# EAGLE design GMP_SCH (EAGLE 9.6.2)
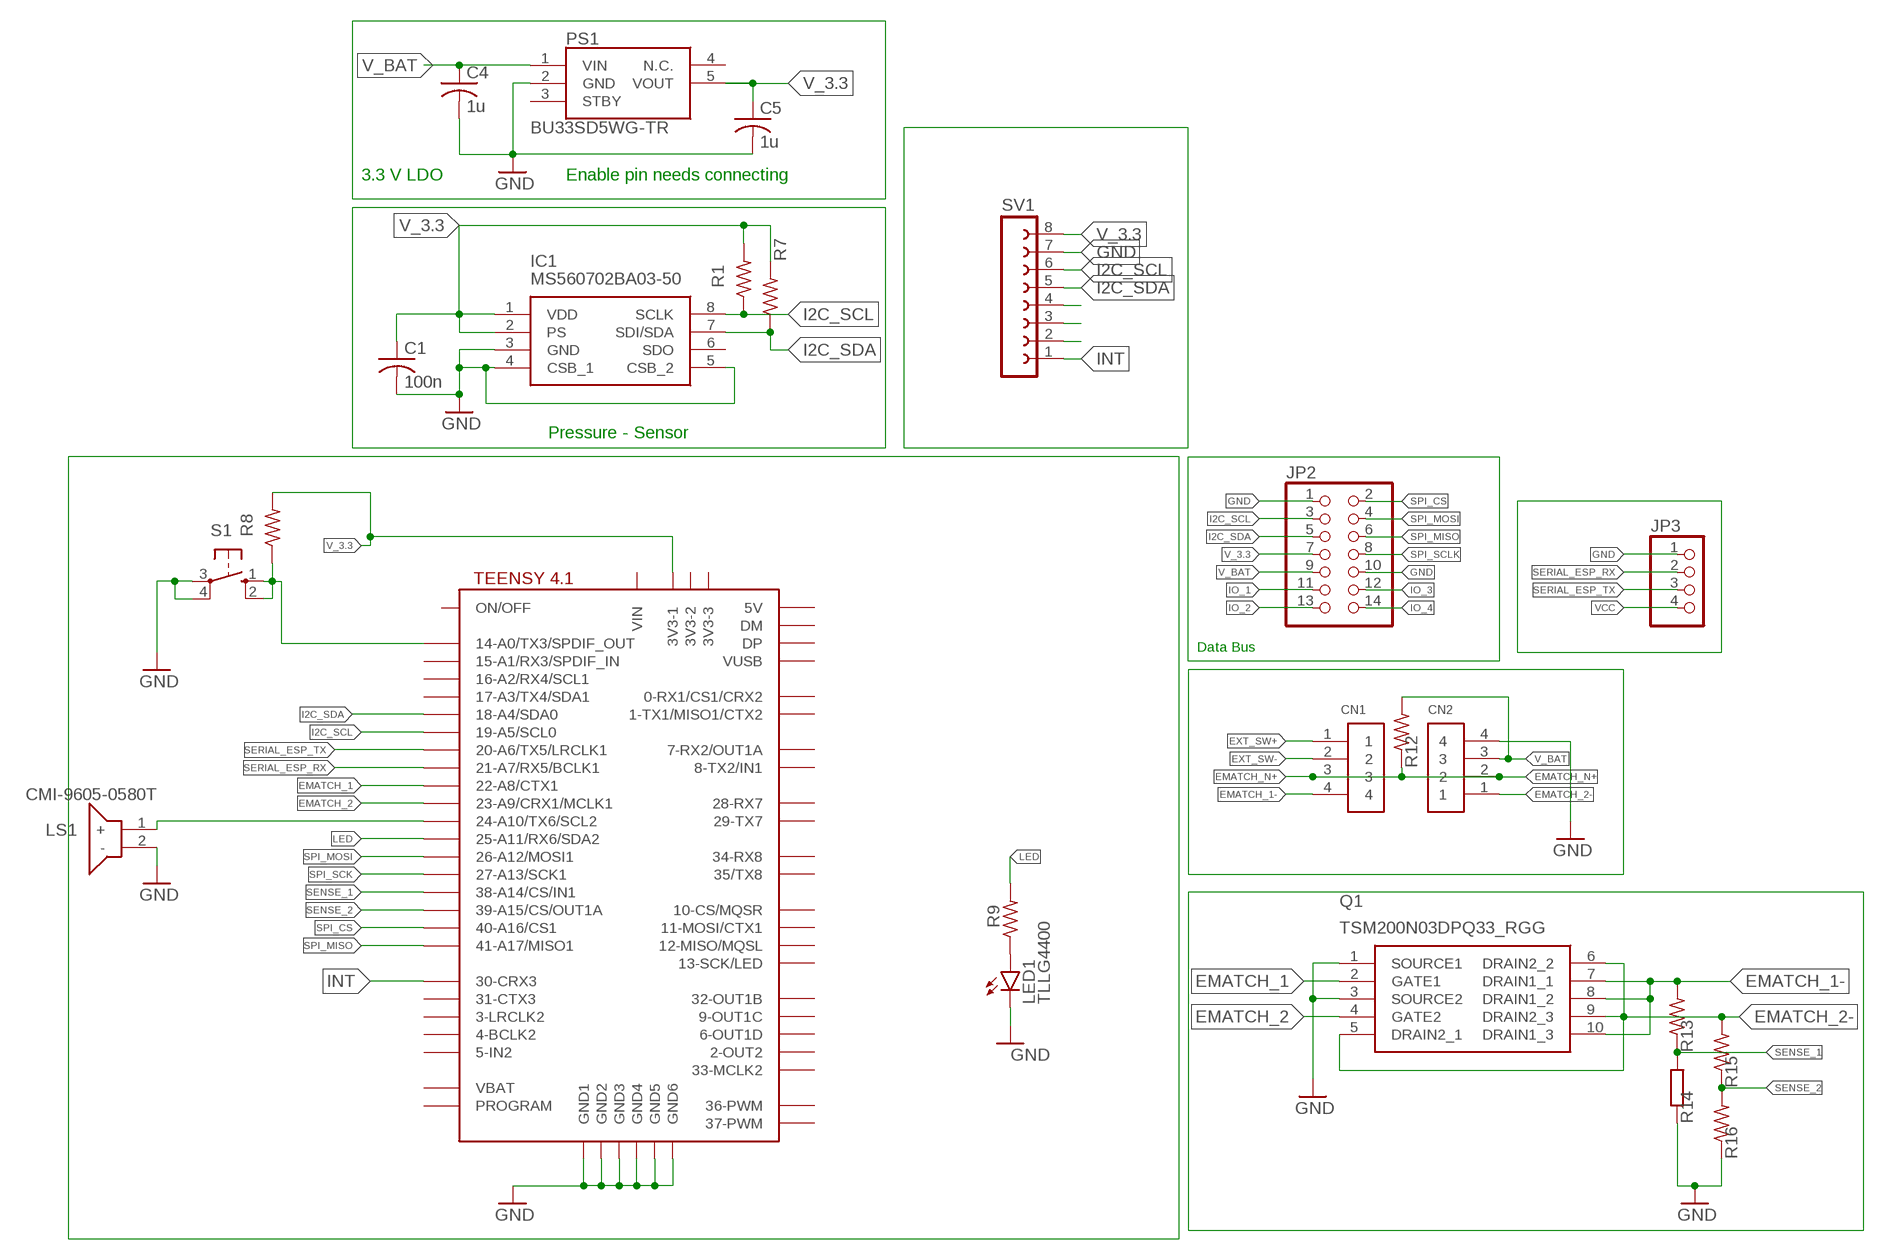
[diagram p0: schematic, sheet 1]

## Parts
C1  100n  C-USC0805  [C0805]
C4  1u  C-USC0805  [C0805]
C5  1u  C-USC0805  [C0805]
CN1  1X4-3.5MM  [1X04-3.5MM]
CN2  1X4-3.5MM  [1X04-3.5MM]
IC1  MS560702BA03-50  [MS5607-02BA03]
JP2  PINHD-2X7  [2X07]
JP3  PINHD-1X4/90  [1X04/90]
LED1  TLLG4400  [LED3MM]
LS1  CMI-9605-0580T  [CMI96050580T]
PS1  BU33SD5WG-TR  [SOT95P280X125-5N]
Q1  TSM200N03DPQ33_RGG  [TSM200N03DPQ33RGG]
R1  10k  FLIPFLOP-RES  [0805-THM]
R7  10k  FLIPFLOP-RES  [0805-THM]
R8  10k  FLIPFLOP-RES  [0805-THM]
R9  2k  FLIPFLOP-RES  [0805-THM]
R12  0  FLIPFLOP-RES  [0805-THM]
R13  100k  FLIPFLOP-RES  [0805-THM]
R14  27k  R-EU_0207/12  [0207/12]
R15  100k  FLIPFLOP-RES  [0805-THM]
R16  27k  FLIPFLOP-RES  [0805-THM]
S1  10-XX  [B3F-10XX]
SV1  FE08-1  [FE08]
U$1  TEENSY41-E  [TENNSY41-E]

## Nets
EMATCH_1: Q1.2(GATE1) U$1.22-A8/CTX1
EMATCH_1-: CN1.4 Q1.7(DRAIN1_1) Q1.8(DRAIN1_2) Q1.10(DRAIN1_3) R13.2
EMATCH_2: Q1.4(GATE2) U$1.23-A9/CRX1/MCLK1
EMATCH_2-: CN2.1 Q1.5(DRAIN2_1) Q1.6(DRAIN2_2) Q1.9(DRAIN2_3) R15.2
EMATCH_N+: CN1.3 CN2.2 R12.1
EXT_SW+: CN1.1
EXT_SW-: CN1.2
GND: C1.2 C4.2 C5.2 CN2.4 IC1.3(GND) IC1.4(CSB_1) IC1.5(CSB_2) JP2.1 JP2.10 JP3.1 LED1.K(C) LS1.2(-) PS1.2(GND) Q1.1(SOURCE1) Q1.3(SOURCE2) R14.1 R16.1 S1.3(P) S1.4(P1) SV1.7 U$1.GND1 U$1.GND2 U$1.GND3 U$1.GND4 U$1.GND5 U$1.GND6
I2C_SCL: IC1.8(SCLK) JP2.3 R1.1 SV1.6 U$1.19-A5/SCL0
I2C_SDA: IC1.7(SDI/SDA) JP2.5 R7.1 SV1.5 U$1.18-A4/SDA0
INT: SV1.1 U$1.30-CRX3
IO_1: JP2.11
IO_2: JP2.13
IO_3: JP2.12
IO_4: JP2.14
LED: R9.2 U$1.25-A11/RX6/SDA2
N$7: SV1.4
N$9: LED1.A R9.1
N$10: SV1.3
N$14: SV1.2
N$15: LS1.1(+) U$1.24-A10/TX6/SCL2
N$19: R8.1 S1.1(S) S1.2(S1) U$1.14-A0/TX3/SPDIF_OUT
SENSE_1: R13.1 R14.2 U$1.38-A14/CS/IN1
SENSE_2: R15.1 R16.2 U$1.39-A15/CS/OUT1A
SERIAL_ESP_RX: JP3.2 U$1.21-A7/RX5/BCLK1
SERIAL_ESP_TX: JP3.3 U$1.20-A6/TX5/LRCLK1
SPI_CS: JP2.2 U$1.40-A16/CS1
SPI_MISO: JP2.6 U$1.41-A17/MISO1
SPI_MOSI: JP2.4 U$1.26-A12/MOSI1
SPI_SCK: U$1.27-A13/SCK1
SPI_SCLK: JP2.8
V_3.3: C1.1 C5.1 IC1.1(VDD) IC1.2(PS) JP2.7 PS1.5(VOUT) R1.2 R7.2 R8.2 SV1.8 U$1.3V3-1
V_BAT: C4.1 CN2.3 JP2.9 PS1.1(VIN) R12.2
VCC: JP3.4
Unconnected: IC1.6(SDO) PS1.3(STBY) PS1.4(N.C.) U$1.0-RX1/CS1/CRX2 U$1.1-TX1/MISO1/CTX2 U$1.2-OUT2 U$1.3-LRCLK2 U$1.3V3-2 U$1.3V3-3 U$1.4-BCLK2 U$1.5-IN2 U$1.6-OUT1D U$1.7-RX2/OUT1A U$1.8-TX2/IN1 U$1.9-OUT1C U$1.10-CS\MQSR(10-CS/MQSR) U$1.11-MOSI/CTX1 U$1.12-MISO/MQSL U$1.13-SCK/LED U$1.15-A1/RX3/SPDIF_IN U$1.16-A2/RX4/SCL1 U$1.17-A3/TX4/SDA1 U$1.28-RX7 U$1.29-TX7 U$1.31-CTX3 U$1.32-OUT1B U$1.33-MCLK2 U$1.34-RX8 U$1.35-TX8(35/TX8) U$1.36-PWM U$1.37-PWM U$1.+5V(5V) U$1.DM U$1.DP U$1.ON/OFF U$1.PROGRAM U$1.VBAT U$1.VIN U$1.VUSB

## Notes on the sheet
- 3.3 V LDO | Enable pin needs connecting
- Pressure - Sensor
- Data Bus

## Library data of the parts
C1 C4 C5 = rcl:C-US: CAPACITOR, American symbol; SPICEPREFIX: C
CN1 CN2 = adafruit:1X4: 4-pin connector
IC1 = MS560702BA03-50:MS560702BA03-50: MS560702BA03-50, Barometric Pressure Sensor, 1200mbar 0 3.6 V Output, 8-Pin QFN Source: Datasheet <http://www.te.com/commerce/DocumentDelivery/DDEController?Action=srchrtrv&DocNm=MS5607-02BA03&DocType=Data Sheet&DocLang=English>; DESCRIPTION: MS560702BA03-50, Barometric Pressure Sensor, 1200mbar 0 3.6 V Output, 8-Pin QFN; HEIGHT: mm; MANUFACTURER_NAME: TE Connectivity; MANUFACTURER_PART_NUMBER: MS560702BA03-50; MOUSER_PART_NUMBER: 824-MS560702BA03-50; MOUSER_PRICE-STOCK: https://www.mouser.co.uk/ProductDetail/Measurement-Specialties/MS560702BA03-50?qs=urSpXqmdEVImCZG1H%252BT8ng%3D%3D
JP2 = pinhead:PINHD-2X7: PIN HEADER
JP3 = pinhead:PINHD-1X4: PIN HEADER
LED1 = led:TLLG4400: Low Current (2mA) LED 3 mm Tinted Diffused Package color GREEN Source: Data sheet <http://www.farnell.com/datasheets/391098.pdf>; MF: VISHAY SEMICONDUCTOR; OC_FARNELL: 1612435
LS1 = CMI-9605-0580T:CMI-9605-0580T: Piezo Buzzers & Audio Indicators buzzer, 9.6 mm x 5 mm deep, M, 5 VDC, 80 dB, Through Hole, Audio Indicator Source: Datasheet <https://componentsearchengine.com/Datasheets/1/CMI-9605-0580T.pdf>; DESCRIPTION: Piezo Buzzers & Audio Indicators buzzer, 9.6 mm x 5 mm deep, M, 5 VDC, 80 dB, Through Hole, Audio Indicator; HEIGHT: 5mm; MANUFACTURER_NAME: CUI Inc.; MANUFACTURER_PART_NUMBER: CMI-9605-0580T; MOUSER_PART_NUMBER: 490-CMI-9605-0580T; MOUSER_PRICE-STOCK: https://www.mouser.co.uk/ProductDetail/CUI-Devices/CMI-9605-0580T?qs=P1JMDcb91o49u9Yh70m6sw%3D%3D
PS1 = BU33SD5WG-TR:BU33SD5WG-TR: LDO regulator,3.3V,0.5A,standby,SSOP5 ROHM BU33SD5WG-TR, LDO Voltage Regulator, 0.5A, 3.3 V +/-2%, 1.7 6 Vin, 5-Pin SSOP Source: Datasheet <https://componentsearchengine.com/Datasheets/1/BU33SD5WG-TR.pdf>; DESCRIPTION: LDO regulator,3.3V,0.5A,standby,SSOP5 ROHM BU33SD5WG-TR, LDO Voltage Regulator, 0.5A, 3.3 V +/-2%, 1.7 6 Vin, 5-Pin SSOP; HEIGHT: 1.25mm; MANUFACTURER_NAME: ROHM Semiconductor; MANUFACTURER_PART_NUMBER: BU33SD5WG-TR; MOUSER_PART_NUMBER: 755-BU33SD5WG-TR; MOUSER_PRICE-STOCK: https://www.mouser.co.uk/ProductDetail/ROHM-Semiconductor/BU33SD5WG-TR?qs=%2FKR40Cd6GUrQDzRkUEt69Q%3D%3D
Q1 = TSM200N03DPQ33_RGG:TSM200N03DPQ33_RGG: MOSFET MOSFET, Dual, N-Ch Trench, 30V, 20A Source: Datasheet <https://www.taiwansemi.com/products/datasheet/TSM200N03D_B1710.pdf>; DESCRIPTION: MOSFET MOSFET, Dual, N-Ch Trench, 30V, 20A; HEIGHT: 0.8mm; MANUFACTURER_NAME: Taiwan Semiconductor; MANUFACTURER_PART_NUMBER: TSM200N03DPQ33 RGG; MOUSER_PART_NUMBER: 821-TSM200N03DPQ33RG; MOUSER_PRICE-STOCK: https://www.mouser.co.uk/ProductDetail/Taiwan-Semiconductor/TSM200N03DPQ33-RGG?qs=BZBei1rCqCAHGBwVoEKNiA%3D%3D
R1 R7-R9 R12 R13 R15 R16 = adafruit:FLIPFLOP-RES: Flip Flop resistor An 0805 resistor inside a standard 1/4W 5% resistor. Makes for easy mods
R14 = rcl:R-EU_: RESISTOR, European symbol; SPICEPREFIX: R
S1 = switch-omron:10-XX: OMRON SWITCH; MPN: B3F-1000; OC_FARNELL: 176432; OC_NEWARK: 36M3542
SV1 = con-lsta:FE08-1: FEMALE HEADER; OC_FARNELL: unknown; OC_NEWARK: unknown
U$1 = teensy:TEENSY41-E

## Net classes
0 default: width 0.305 mm, clearance 0.254 mm

## Board
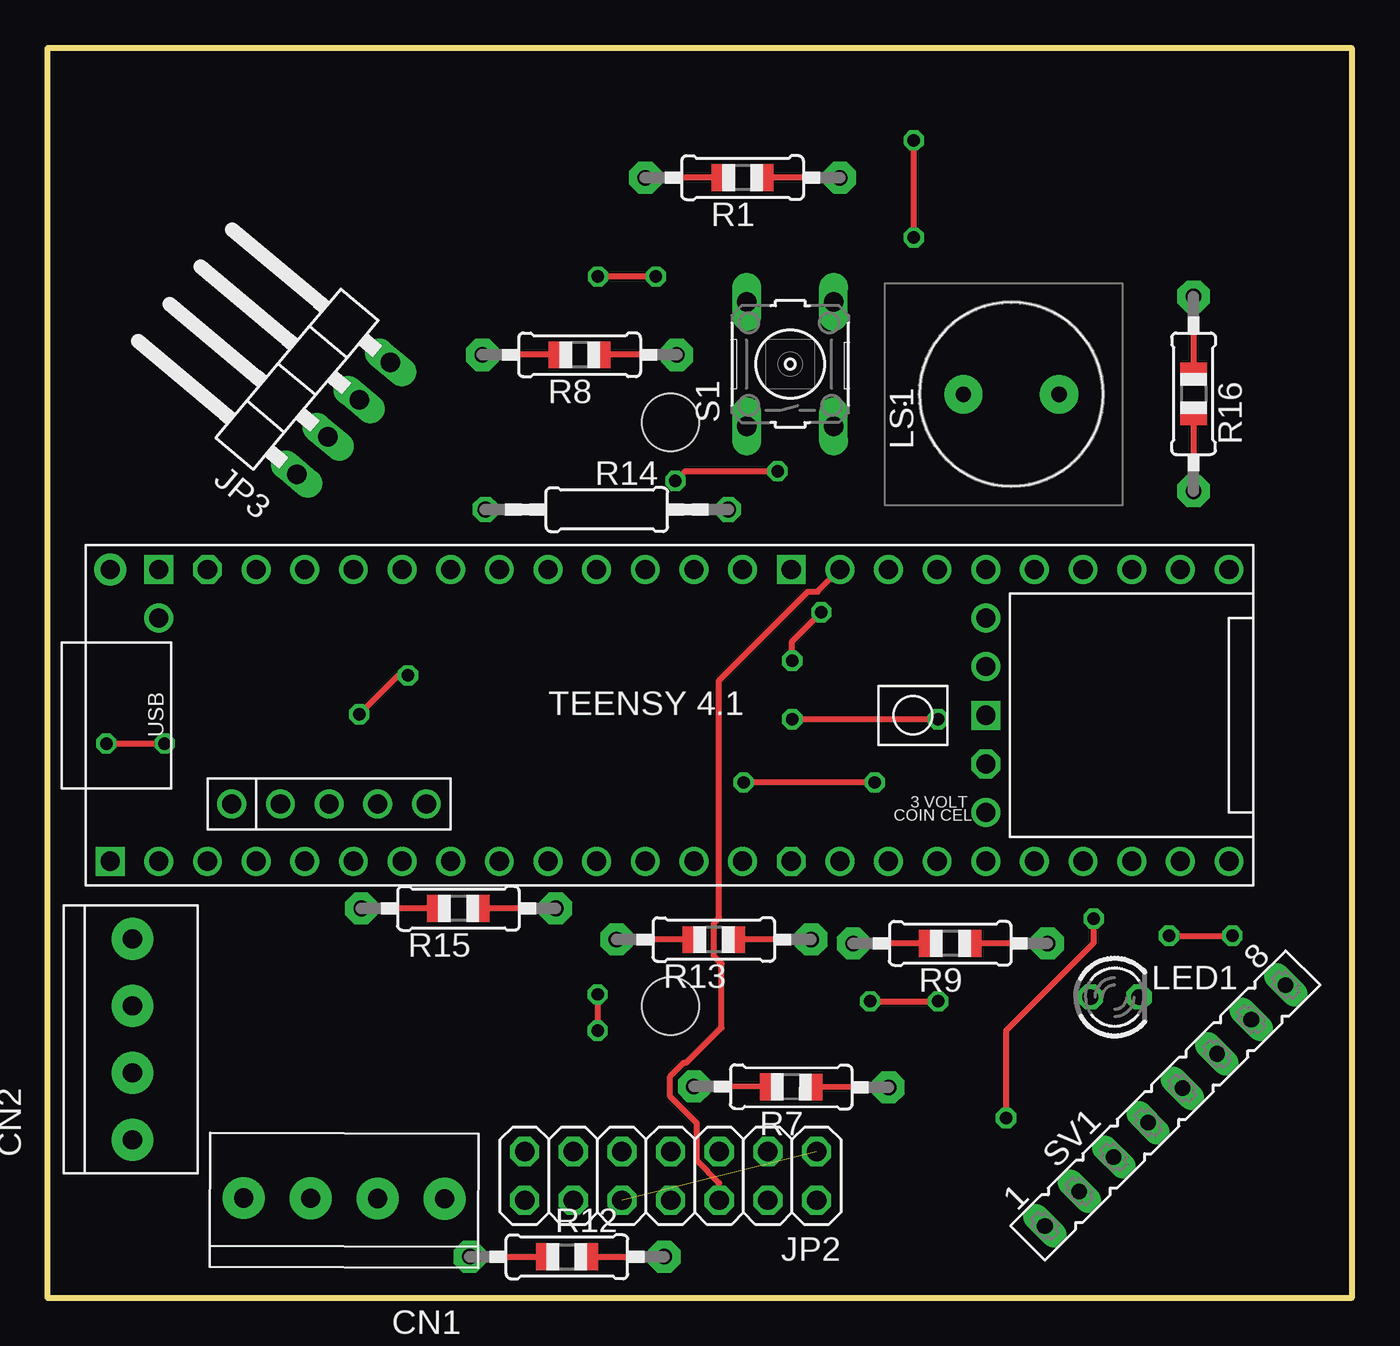
[diagram p1: board, top side]
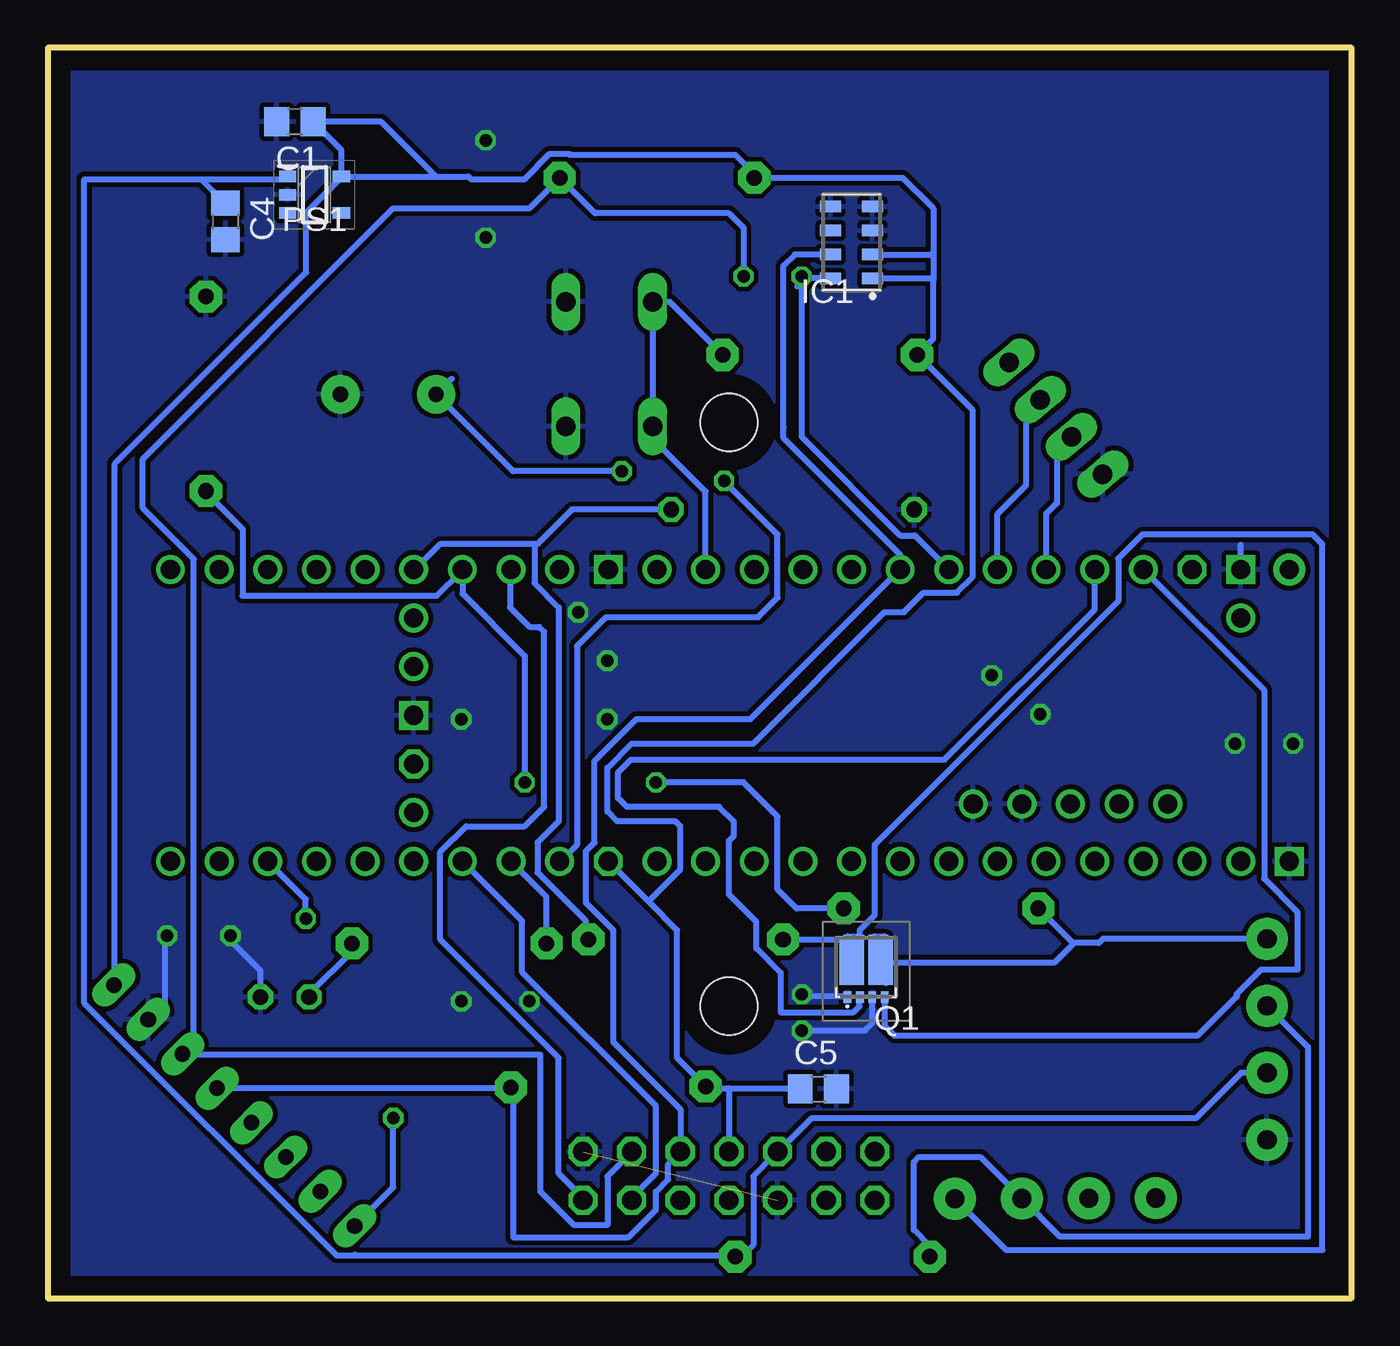
[diagram p2: board, bottom side, seen from below]

Size 68.07 x 65.28 mm. Coordinates in mm from the lower left corner, seen from the top.
Outline: 0,0 0,65.28 68.07,65.28 68.07,0 0,0
Copper layers (1*16): Top 0.035mm / dielectric 1.5mm / Bottom 0.035mm
Design rules "default": minimum track width 6mil, minimum drill 0.35mm, track to track 6mil, track to pad 6mil, pad to pad 6mil, via to via 6mil, smd to smd 6mil, copper to edge 40mil, drill to drill 6mil, minimum pad ring 10mil, minimum via ring 8mil, stop-mask expansion 4mil, vias tented up to drill 0mil, thermal gap 10mil
Holes 3 mm at 32.51,15.24 32.51,45.72

### Footprints (pad centres in the part's own frame; a part is rotated, then mirrored left to right if it is on the bottom)
C0805 = smd 1.3 x 1.5: 1 -0.95,0; 2 0.95,0
1X04-3.5MM = drill 1 pad 2.184: 1 -5.25,0; 2 -1.75,0; 3 1.75,0; 4 5.25,0
MS5607-02BA03 = smd 1.1 x 0.6: 1 -1.1,1.875; 2 -1.1,0.625; 3 -1.1,-0.625; 4 -1.1,-1.875; 5 1.1,-1.875; 6 1.1,-0.625; 7 1.1,0.625; 8 1.1,1.875
2X07 = drill 1.016 octagon: 1 -7.62,-1.27; 2 -7.62,1.27; 3 -5.08,-1.27; 4 -5.08,1.27; 5 -2.54,-1.27; 6 -2.54,1.27; 7 0,-1.27; 8 0,1.27; 9 2.54,-1.27; 10 2.54,1.27; 11 5.08,-1.27; 12 5.08,1.27; 13 7.62,-1.27; 14 7.62,1.27
1X04/90 = drill 1.016 long: 1 -3.81,-3.81; 2 -1.27,-3.81; 3 1.27,-3.81; 4 3.81,-3.81
LED3MM = drill 0.813 octagon: A -1.27,0; K 1.27,0
CMI96050580T = drill 0.8 pad 2: 1 0,0; 2 0,-5
SOT95P280X125-5N = smd 0.9 x 0.6: 1 -1.4,0.95; 2 -1.4,0; 3 -1.4,-0.95; 4 1.4,-0.95; 5 1.4,0.95
TSM200N03DPQ33RGG = smd 0.4 x 0.6: 1 -0.975,-1.563; 2 -0.325,-1.563; 3 0.325,-1.563; 4 0.975,-1.563 | smd 0.4 x 0.25: 5 0.975,1.563; 6 0.31,1.563; 7 -0.31,1.563; 8 -0.975,1.563 | smd 1.29 x 2.35: 9 0.755,0.262; 10 -0.755,0.262
0805-THM = drill 0.813 pad 1.676 octagon: 1 -5.08,0; 2 5.08,0
0207/12 = drill 0.813 octagon: 1 -6.35,0; 2 6.35,0
B3F-10XX = drill 1.016 long: 1 -3.251,2.261; 2 3.251,2.261; 3 -3.251,-2.261; 4 3.251,-2.261
FE08 = drill 0.813 long: 1 -8.89,0; 2 -6.35,0; 3 -3.81,0; 4 -1.27,0; 5 1.27,0; 6 3.81,0; 7 6.35,0; 8 8.89,0
TENNSY41-E = drill 1: 0-RX1/CS1/CRX2 -27.94,-7.62; 1-TX1/MISO1/CTX2 -25.4,-7.62; 2-OUT2 -22.86,-7.62; 3-LRCLK2 -20.32,-7.62; 4-BCLK2 -17.78,-7.62; 5-IN2 -15.24,-7.62; 6-OUT1D -12.7,-7.62; 7-RX2/OUT1A -10.16,-7.62; 8-TX2/IN1 -7.62,-7.62; 9-OUT1C -5.08,-7.62; 10-CS\MQSR -2.54,-7.62; 11-MOSI/CTX1 0,-7.62; 12-MISO/MQSL 2.54,-7.62; 13-SCK/LED 2.54,7.62; 14-A0/TX3/SPDIF_OUT 0,7.62; 15-A1/RX3/SPDIF_IN -2.54,7.62; 16-A2/RX4/SCL1 -5.08,7.62; 17-A3/TX4/SDA1 -7.62,7.62; 18-A4/SDA0 -10.16,7.62; 19-A5/SCL0 -12.7,7.62; 20-A6/TX5/LRCLK1 -15.24,7.62; 21-A7/RX5/BCLK1 -17.78,7.62; 22-A8/CTX1 -20.32,7.62; 23-A9/CRX1/MCLK1 -22.86,7.62; 24-A10/TX6/SCL2 7.62,-7.62; 25-A11/RX6/SDA2 10.16,-7.62; 26-A12/MOSI1 12.7,-7.62; 27-A13/SCK1 15.24,-7.62; 28-RX7 17.78,-7.62; 29-TX7 20.32,-7.62; 30-CRX3 22.86,-7.62; 31-CTX3 25.4,-7.62; 32-OUT1B 27.94,-7.62; 33-MCLK2 27.94,7.62; 34-RX8 25.4,7.62; 35-TX8 22.86,7.62; 36-PWM 20.32,7.62; 37-PWM 17.78,7.62; 38-A14/CS/IN1 15.24,7.62; 39-A15/CS/OUT1A 12.7,7.62; 40-A16/CS1 10.16,7.62; 41-A17/MISO1 7.62,7.62; +5V -24.13,-4.62; DM -21.59,-4.62; DP -19.05,-4.62; GND4 -16.51,-4.62; GND5 -13.97,-4.62; ON/OFF 15.24,5.08; PROGRAM 15.24,2.54; VBAT 15.24,-5.08; VUSB -27.94,5.08 | drill 1 octagon: 3V3-1 5.08,-7.62; 3V3-2 15.24,-2.54; 3V3-3 -25.4,7.62 | drill 1 square: GND1 -30.48,-7.62; GND2 15.24,0; GND3 5.08,7.62; GND6 -27.94,7.62 | drill 1 pad 1.676: VIN -30.48,7.62

### Placement (x,y rotation side)
C1  55.17,61.42 180 bottom
C4  58.8,56.21 270 bottom
C5  27.84,10.92 0 bottom
CN1  15.47,5.21 359.8 top
CN2  4.42,13.51 270 top
IC1  26.11,55.12 180 bottom
JP2  32.51,6.38 180 top
JP3  12.52,48.39 50 top
LED1  55.7,15.72 0 top
LS1  47.8,47.19 90 top
PS1  54.15,57.61 0 bottom
Q1  25.35,17.27 0 bottom
R1  36.27,58.5 180 top
R7  38.81,11.02 179.7 top
R8  27.76,49.25 180 top
R9  47.12,18.52 180 top
R12  27.1,2.16 0 top
R13  34.77,18.72 180 top
R14  29.18,41.17 0 top
R15  21.44,20.35 180 top
R16  59.82,47.22 270 top
S1  38.76,48.77 90 top
SV1  58.34,10.06 45 top
U$1  33.73,30.43 0 top

### Tracks (layer width: path | path; a pad name or v marks a point on that pad's centre or on a via)
EMATCH_1
  Bottom 0.305: Q1.2 25.69,15.56 25.69,15.24 26,14.92 29.81,14.92 29.81,16.99 31.08,18.26 31.08,19.65 32.51,21.08 32.51,23.88 32.26,24.13 32.26,24.89 33.02,25.65 37.85,25.65 38.3,26.11 38.3,27.43 37.62,28.11 21.26,28.11 13.41,35.96 U$1.22-A8/CTX1
EMATCH_1-
  Bottom 0.305: 25.69,18.89 26.32,18.89 Q1.8 | 25.69,18.89 Q1.7 | Q1.8 26.32,18.73 26.16,18.57 26.16,17.62 Q1.10 | Q1.8 26.48,18.73 29.65,18.73 R13.2 | CN1.4 20.61,5.08 18.03,2.51 1.52,2.51 1.52,39.37 2.03,39.88 10.92,39.88 12.19,38.61 12.19,36.39 24.89,23.69 24.89,20 25.69,19.21 25.69,18.89
EMATCH_2
  Bottom 0.305: 6,15.75 6,15.88 4.73,17.14 2.83,17.14 2.83,20.16 4.57,21.91 4.57,31.75 U$1.23-A9/CRX1/MCLK1 | 6,15.75 6,15.72 | 24.26,15.72 Q1.4 24.38,15.7 24.38,14.22 23.88,13.72 8.03,13.72 6,15.75
EMATCH_2-
  Bottom 0.305: Q1.6 24.89,18.89 24.42,18.89 Q1.5 24.42,18.73 24.57,18.57 24.57,17.62 Q1.9 | 24.3,16.45 Q1.9 | 4.57,18.89 CN2.1 12.99,18.76 13.21,18.54 14.48,18.54 | 14.48,18.54 14.55,18.54 R15.2 | 14.48,18.54 15.49,17.53 Q1.9
EMATCH_N+
  Bottom 0.305: 4.57,14.45 4.57,15.24 CN2.2 2.29,13.13 2.29,3.2 15.22,3.2 CN1.3 19.38,7.37 22.61,7.37 22.86,7.11 22.86,3.56 22.02,2.72 R12.1 22.04,2.1
GND  (via drill 0.65)  (1 unrouted)
  Top 0.305: v38.86,30.23 v46.48,30.23 | v45.21,55.37 v45.21,60.45 | v3.05,28.96 v6.1,28.96 | v58.55,18.92 61.59,18.92 61.72,18.8 v61.85,18.92 | v28.7,15.86 v28.7,13.97 | v16.26,30.48 18.29,32.51 v18.8,32.51 | v42.93,15.49 v46.48,15.49 | v38.86,33.27 38.86,34.29 v40.39,35.81
  Bottom 0.305: U$1.GND6 5.79,39.32 | LED1.K 56.97,17.09 58.67,18.8 v58.55,18.92 | v61.85,18.92 61.98,18.8 61.98,15.41 SV1.7 | Q1.1 26.36,15.75 28.59,15.75 v28.7,15.86 | v28.7,13.97 25.4,13.97 25.02,14.35 Q1.3
  pour Bottom: 1.19,0.43 1.19,64.57 67.72,64.57 67.72,0.43
I2C_SCL  (via drill 0.65)
  Top 0.305: v31.75,53.34 v28.72,53.34
  Bottom 0.305: U$1.19-A5/SCL0 22.81,39.83 23.57,39.83 28.72,44.98 v28.72,53.34 28.62,53.24 28.55,53.24 | 60.45,12.7 42.35,12.7 42.35,5.56 40.61,3.81 38.86,3.81 38.86,6.35 37.59,7.62 JP2.3 | 60.45,12.7 60.93,12.7 SV1.6 60.45,12.7 | 60.45,12.7 60.45,38.58 63.12,41.24 63.12,43.81 50.04,56.9 42.93,56.9 41.35,58.47 R1.1 39.5,56.64 32.51,56.64 31.75,55.88 v31.75,53.34 | IC1.8 28.55,53.24 | 28.55,53.24 28.96,52.83
I2C_SDA
  Bottom 0.305: SV1.5 59.18,10.95 43.94,10.95 R7.1 43.78,10.95 43.78,3.17 37.75,3.17 36.32,4.6 36.32,5.56 35.69,6.19 35.69,6.99 35.05,7.62 JP2.5 35.05,9.87 38.55,13.36 38.55,19.21 39.97,20.64 39.97,23.34 39.53,23.78 39.53,28.04 37.34,30.23 31.39,30.23 U$1.18-A4/SDA0 23.57,38.81 29.65,44.9 29.65,45.47 29.65,53.91 29.07,54.49 IC1.7
INT  (via drill 0.65)
  Top 0.305: v50.04,9.4 50.04,13.97 54.61,18.54 v54.61,19.81
  Bottom 0.305: SV1.1 50.04,5.79 v50.04,9.4 | v54.61,19.81 54.61,20.83 U$1.30-CRX3
LED
  Bottom 0.305: U$1.25-A11/RX6/SDA2 42.04,20.95 R9.2
N$9
  Bottom 0.305: R9.1 52.2,18.1 54.42,15.88 LED1.A
N$15  (via drill 0.65)
  Top 0.305: v32.77,42.67 33.27,43.18 v38.1,43.18 38.35,43.18
  Bottom 0.305: U$1.24-A10/TX6/SCL2 41.24,22.86 40.45,23.65 40.45,34.04 38.93,35.56 30.99,35.56 29.97,36.58 29.97,39.88 v32.77,42.67 | 46.99,48.01 LS1.1 43.79,43.18 v38.1,43.18
N$19
  Bottom 0.305: R8.1 35.61,52.02 S1.2 S1.1 36.5,44.88 33.73,42.11 U$1.14-A0/TX3/SPDIF_OUT
SENSE_1
  Bottom 0.305: 42.67,39.37 42.51,39.37 40.71,41.17 R14.2 | 42.67,39.37 47.59,39.37 48.86,38.1 U$1.38-A14/CS/IN1 | R13.1 39.97,18.73 39.97,19.68 42.51,22.23 42.51,23.78 41.4,24.89 41.4,36.07 42.67,37.34 42.67,39.37
SENSE_2  (via drill 0.65)
  Top 0.305: v43.18,26.92 v36.32,26.92
  Bottom 0.305: R16.2 59.82,42.07 57.91,40.16 57.91,36.67 47.75,36.67 46.48,37.94 U$1.39-A15/CS/OUT1A 46.43,36.78 43.18,33.53 v43.18,26.92 | R15.1 28.98,20.34 29.97,21.34 29.97,25.15 31.75,26.92 v36.32,26.92
SERIAL_ESP_RX
  Bottom 0.305: JP3.2 15.39,44.2 15.39,41.51 15.95,40.95 U$1.21-A7/RX5/BCLK1
SERIAL_ESP_TX
  Bottom 0.305: U$1.20-A6/TX5/LRCLK1 18.49,40.95 17.02,42.42 17.02,46.15 JP3.3
SPI_CS
  Bottom 0.305: 43.94,37.94 U$1.40-A16/CS1 43.94,38 43.94,36.07 42.93,35.05 42.42,35.05 42.16,34.8 42.16,25.65 43.18,24.64 46.23,24.64 46.9,23.97 46.91,23.97 47.59,23.29 47.59,18.73 41.4,12.54 41.4,6.51 40.13,5.24 JP2.2
SPI_MISO
  Top 0.305: JP2.6 35.05,5.99 33.88,7.16 33.88,9.13 32.48,10.53 32.48,11.57 33.22,12.3 33.34,12.3 35.18,14.13 35.18,17.46 34.79,17.85 34.79,19.59 35.05,19.85 35.05,32.26 39.68,36.89 40.19,36.89 U$1.41-A17/MISO1 40.89,38.05
SPI_MOSI
  Bottom 0.305: U$1.26-A12/MOSI1 43.31,19.68 43.31,17.02 36.32,10.03 36.32,6.51 37.59,5.24 JP2.4
V_3.3
  Bottom 0.305: PS1.5 52.83,58.42 54.58,56.67 54.58,53.56 64.58,43.56 64.58,16.35 SV1.8 | 25.05,53.18 IC1.1 | 32.51,10.95 33.62,10.95 R7.2 33.78,11.11 35.21,12.54 35.21,19.21 36.72,20.72 | 32.51,10.95 28.86,10.95 C5.1 | 36.72,20.72 U$1.3V3-1 | 32.51,10.95 JP2.7 | 36.72,20.72 35.05,22.38 35.05,24.64 35.31,24.89 38.35,24.89 38.86,25.4 38.86,27.69 37.59,28.96 31.24,28.96 24.38,35.81 23.37,35.81 22.35,36.83 20.61,36.83 19.81,37.62 19.81,46.38 R8.2 21.84,50.09 21.84,53.09 | 52.67,58.58 PS1.5 | IC1.2 21.98,54.49 21.84,54.36 | 21.84,54.36 21.84,53.09 | 24.85,53.09 IC1.1 | IC1.1 22,53.24 21.84,53.09 | 47.8,58.56 50.66,61.42 C1.1 52.75,59.95 PS1.5 | R1.2 30.99,58.5 | 30.99,58.5 23.44,58.5 21.84,56.9 21.84,54.36 | 30.99,58.5 32.18,59.69 40.78,59.69 40.84,59.74 41.87,59.74 43.19,58.42 45.97,58.42 46.11,58.56 PS1.5
V_BAT
  Bottom 0.305: 60.06,58.42 66.17,58.42 66.17,15.4 52.99,2.22 52.97,2.24 52.08,2.24 | 60.06,58.42 55.69,58.42 PS1.1 | 29.97,7.62 30.23,7.37 31.24,6.35 31.24,2.79 31.88,2.16 R12.2 32.26,2.24 52.08,2.24 | 29.97,7.62 JP2.9 | 4.57,11.75 CN2.3 5.76,11.76 8.13,9.4 28.19,9.4 29.97,7.62 | C4.1 60.06,58.42 | 52.03,2.29 52.08,2.24

### Text on the board
bRestrict: Piatt Labs | V1.2 | Not because / it is easy / but because / it is hard | Matthew / 10:28
tSilk: V1.0 | Piatt Labs